# Altium schematic sheet top.SchDoc
size A4
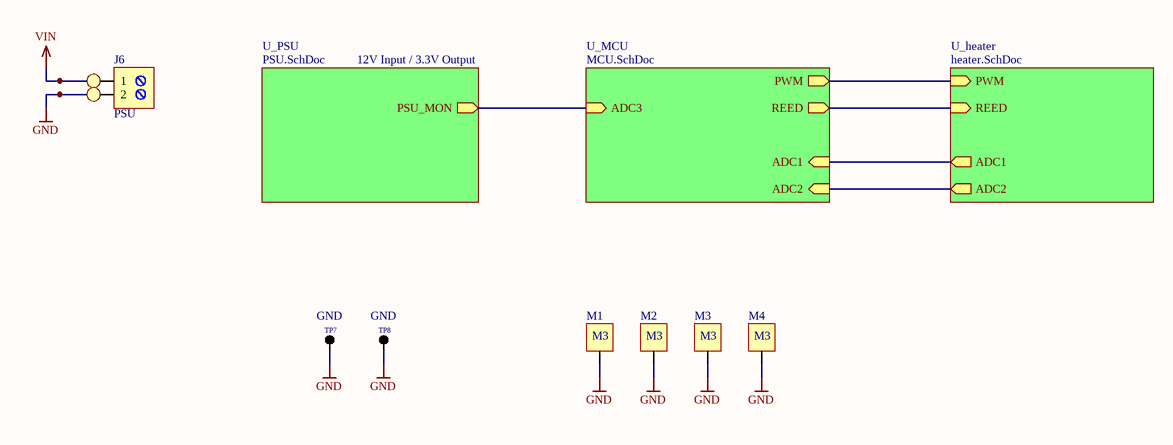
[diagram p0: top.SchDoc]

## Parts
J6  PSU  [J_ARK2]
M1  M3 Hole  [M3 Hole]  (value not drawn)
M2  M3 Hole  [M3 Hole]  (value not drawn)
M3  M3 Hole  [M3 Hole]  (value not drawn)
M4  M3 Hole  [M3 Hole]  (value not drawn)
PAD1  PAD  [PAD_08mm]  (value not drawn)
PAD2  PAD  [PAD_08mm]  (value not drawn)
TP7  GND  [TP_PAD]
TP8  GND  [TP_PAD]

## Sub-sheets
U_heater = heater.SchDoc: PWM (in), ADC2 (out), ADC1 (out), REED (in)
U_MCU = MCU.SchDoc: PWM (out), ADC2 (in), ADC1 (in), REED (out), ADC3 (in)
U_PSU = PSU.SchDoc: PSU_MON (out)

## Nets
GND: J6.2 M1.1 M2.1 M3.1 M4.1 PAD2.1 TP7.1(TP) TP8.1(TP)
VIN: J6.1 PAD1.1
(unnamed): sheet U_PSU/PSU_MON, sheet U_MCU/ADC3
(unnamed): sheet U_MCU/PWM, sheet U_heater/PWM
(unnamed): sheet U_MCU/ADC2, sheet U_heater/ADC2
(unnamed): sheet U_MCU/ADC1, sheet U_heater/ADC1
(unnamed): sheet U_MCU/REED, sheet U_heater/REED

## Notes on the sheet
- 12V Input / 3.3V Output
- (in symbol M3 Hole) M3

## Library data of the parts
J6 = J_TB-5.0-P-2P: ARK Screw terminal, 2-Pin; Manufacturer: DEGSON ELECTRONICS; Value: DG301-5.0-02P-12-18A(H); SCH_Footprint: ARK2; Part Number: J_TB-5.0-P-2P; Component Type: Standard; HelpURL: https://datasheet.octopart.com/DG301-5.0-03P-12-18A%28H%29-Degson-datasheet-17801202.pdf; Manufacturer Part Number: DG301-5.0-02P-12-18A(H); Supplier 1: TME; Supplier Part Number 1: DG301-5.0-2/6B; Supplier 2: RS Components; Supplier 3: Farnell; Supplier 4: Mouser; Supplier 5: Digi-Key
M1-M4 = M3 Hole: Inner diamater 3.25 mm Outer diamerer 6 mm
PAD1 PAD2 = J_PAD: PCB Pad; Part Number: J_PAD; SCH_Footprint: 1.4x2.5mm; Supplier 1: TME; Supplier 2: RS Components; Supplier 3: Farnell; Supplier 4: Mouser; Supplier 5: Digi-Key; Supplier 6: LCSC
TP7 TP8 = TP_PAD: Testpoint; SCH_Footprint: SMD; Part Number: TP_PAD; Supplier 1: TME; Supplier 2: RS Components; Supplier 3: Farnell; Supplier 4: Mouser; Supplier 5: Digi-Key; Supplier 6: LCSC